# EAGLE design MainMatrix (EAGLE 9.1.1)
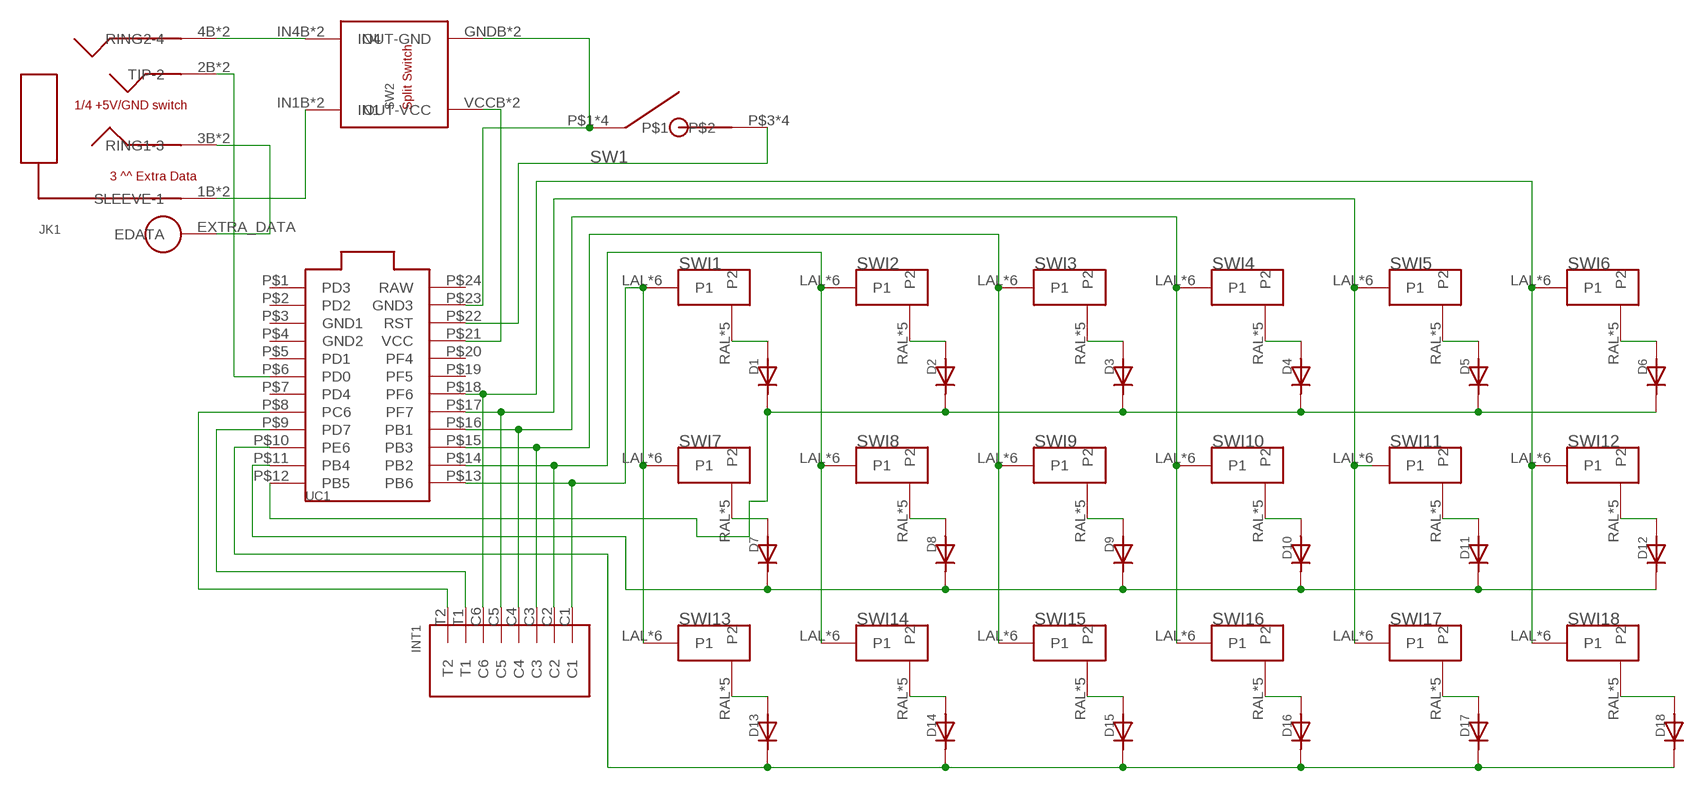
[diagram p0: schematic, sheet 1]

## Parts
D1  DIODE  [DIODE_COMBO]
D2  DIODE  [DIODE_COMBO]
D3  DIODE  [DIODE_COMBO]
D4  DIODE  [DIODE_COMBO]
D5  DIODE  [DIODE_COMBO]
D6  DIODE  [DIODE_COMBO]
D7  DIODE  [DIODE_COMBO]
D8  DIODE  [DIODE_COMBO]
D9  DIODE  [DIODE_COMBO]
D10  DIODE  [DIODE_COMBO]
D11  DIODE  [DIODE_COMBO]
D12  DIODE  [DIODE_COMBO]
D13  DIODE  [DIODE_COMBO]
D14  DIODE  [DIODE_COMBO]
D15  DIODE  [DIODE_COMBO]
D16  DIODE  [DIODE_COMBO]
D17  DIODE  [DIODE_COMBO]
D18  DIODE  [DIODE_COMBO]
INT1  INTRCNNT4X2  [INTRRIBBON]
JK1  TRRSJACKUNDER  [TRRSJACK]
SW1  RSTSWSMD  [FLATSWT]
SW2  TRANSFERPADDY  [TRANSFER_PADS]
SWI1  MX/ALPSDOUBLESIDED  [DOUBLED_MX/ALPS]
SWI2  MX/ALPSDOUBLESIDED  [DOUBLED_MX/ALPS]
SWI3  MX/ALPSDOUBLESIDED  [DOUBLED_MX/ALPS]
SWI4  MX/ALPSDOUBLESIDED  [DOUBLED_MX/ALPS]
SWI5  MX/ALPSDOUBLESIDED  [DOUBLED_MX/ALPS]
SWI6  MX/ALPSDOUBLESIDED  [DOUBLED_MX/ALPS]
SWI7  MX/ALPSDOUBLESIDED  [DOUBLED_MX/ALPS]
SWI8  MX/ALPSDOUBLESIDED  [DOUBLED_MX/ALPS]
SWI9  MX/ALPSDOUBLESIDED  [DOUBLED_MX/ALPS]
SWI10  MX/ALPSDOUBLESIDED  [DOUBLED_MX/ALPS]
SWI11  MX/ALPSDOUBLESIDED  [DOUBLED_MX/ALPS]
SWI12  MX/ALPSDOUBLESIDED  [DOUBLED_MX/ALPS]
SWI13  MX/ALPSDOUBLESIDED  [DOUBLED_MX/ALPS]
SWI14  MX/ALPSDOUBLESIDED  [DOUBLED_MX/ALPS]
SWI15  MX/ALPSDOUBLESIDED  [DOUBLED_MX/ALPS]
SWI16  MX/ALPSDOUBLESIDED  [DOUBLED_MX/ALPS]
SWI17  MX/ALPSDOUBLESIDED  [DOUBLED_MX/ALPS]
SWI18  MX/ALPSDOUBLESIDED  [DOUBLED_MX/ALPS]
UC1  PROMICROUNDER  [PROMICRO_UNDER]

## Nets
N$1: INT1.C5 SWI5.LAL(P1) SWI5.LAR(P1) SWI5.LCL(P1) SWI5.LCR(P1) SWI5.LLP(P1) SWI5.LRLP(P1) SWI11.LAL(P1) SWI11.LAR(P1) SWI11.LCL(P1) SWI11.LCR(P1) SWI11.LLP(P1) SWI11.LRLP(P1) SWI17.LAL(P1) SWI17.LAR(P1) SWI17.LCL(P1) SWI17.LCR(P1) SWI17.LLP(P1) SWI17.LRLP(P1) UC1.P$17(PF7)
N$2: D1.ANOSB(AN) D1.ANOST(AN) D1.ANOT(AN) SWI1.RAL(P2) SWI1.RAR(P2) SWI1.RCL(P2) SWI1.RCR(P2) SWI1.RLMID(P2)
N$3: D2.ANOSB(AN) D2.ANOST(AN) D2.ANOT(AN) SWI2.RAL(P2) SWI2.RAR(P2) SWI2.RCL(P2) SWI2.RCR(P2) SWI2.RLMID(P2)
N$4: D3.ANOSB(AN) D3.ANOST(AN) D3.ANOT(AN) SWI3.RAL(P2) SWI3.RAR(P2) SWI3.RCL(P2) SWI3.RCR(P2) SWI3.RLMID(P2)
N$5: D4.ANOSB(AN) D4.ANOST(AN) D4.ANOT(AN) SWI4.RAL(P2) SWI4.RAR(P2) SWI4.RCL(P2) SWI4.RCR(P2) SWI4.RLMID(P2)
N$6: D5.ANOSB(AN) D5.ANOST(AN) D5.ANOT(AN) SWI5.RAL(P2) SWI5.RAR(P2) SWI5.RCL(P2) SWI5.RCR(P2) SWI5.RLMID(P2)
N$7: D6.ANOSB(AN) D6.ANOST(AN) D6.ANOT(AN) SWI6.RAL(P2) SWI6.RAR(P2) SWI6.RCL(P2) SWI6.RCR(P2) SWI6.RLMID(P2)
N$8: D7.ANOSB(AN) D7.ANOST(AN) D7.ANOT(AN) SWI7.RAL(P2) SWI7.RAR(P2) SWI7.RCL(P2) SWI7.RCR(P2) SWI7.RLMID(P2)
N$9: D8.ANOSB(AN) D8.ANOST(AN) D8.ANOT(AN) SWI8.RAL(P2) SWI8.RAR(P2) SWI8.RCL(P2) SWI8.RCR(P2) SWI8.RLMID(P2)
N$10: D9.ANOSB(AN) D9.ANOST(AN) D9.ANOT(AN) SWI9.RAL(P2) SWI9.RAR(P2) SWI9.RCL(P2) SWI9.RCR(P2) SWI9.RLMID(P2)
N$11: D10.ANOSB(AN) D10.ANOST(AN) D10.ANOT(AN) SWI10.RAL(P2) SWI10.RAR(P2) SWI10.RCL(P2) SWI10.RCR(P2) SWI10.RLMID(P2)
N$12: D11.ANOSB(AN) D11.ANOST(AN) D11.ANOT(AN) SWI11.RAL(P2) SWI11.RAR(P2) SWI11.RCL(P2) SWI11.RCR(P2) SWI11.RLMID(P2)
N$13: D12.ANOSB(AN) D12.ANOST(AN) D12.ANOT(AN) SWI12.RAL(P2) SWI12.RAR(P2) SWI12.RCL(P2) SWI12.RCR(P2) SWI12.RLMID(P2)
N$14: D13.ANOSB(AN) D13.ANOST(AN) D13.ANOT(AN) SWI13.RAL(P2) SWI13.RAR(P2) SWI13.RCL(P2) SWI13.RCR(P2) SWI13.RLMID(P2)
N$15: D14.ANOSB(AN) D14.ANOST(AN) D14.ANOT(AN) SWI14.RAL(P2) SWI14.RAR(P2) SWI14.RCL(P2) SWI14.RCR(P2) SWI14.RLMID(P2)
N$16: D15.ANOSB(AN) D15.ANOST(AN) D15.ANOT(AN) SWI15.RAL(P2) SWI15.RAR(P2) SWI15.RCL(P2) SWI15.RCR(P2) SWI15.RLMID(P2)
N$17: D16.ANOSB(AN) D16.ANOST(AN) D16.ANOT(AN) SWI16.RAL(P2) SWI16.RAR(P2) SWI16.RCL(P2) SWI16.RCR(P2) SWI16.RLMID(P2)
N$18: D17.ANOSB(AN) D17.ANOST(AN) D17.ANOT(AN) SWI17.RAL(P2) SWI17.RAR(P2) SWI17.RCL(P2) SWI17.RCR(P2) SWI17.RLMID(P2)
N$19: D18.ANOSB(AN) D18.ANOST(AN) D18.ANOT(AN) SWI18.RAL(P2) SWI18.RAR(P2) SWI18.RCL(P2) SWI18.RCR(P2) SWI18.RLMID(P2)
N$20: D1.CATSB(CAT) D1.CATST(CAT) D1.CATT(CAT) D2.CATSB(CAT) D2.CATST(CAT) D2.CATT(CAT) D3.CATSB(CAT) D3.CATST(CAT) D3.CATT(CAT) D4.CATSB(CAT) D4.CATST(CAT) D4.CATT(CAT) D5.CATSB(CAT) D5.CATST(CAT) D5.CATT(CAT) D6.CATSB(CAT) D6.CATST(CAT) D6.CATT(CAT) UC1.P$12(PB5)
N$21: D7.CATSB(CAT) D7.CATST(CAT) D7.CATT(CAT) D8.CATSB(CAT) D8.CATST(CAT) D8.CATT(CAT) D9.CATSB(CAT) D9.CATST(CAT) D9.CATT(CAT) D10.CATSB(CAT) D10.CATST(CAT) D10.CATT(CAT) D11.CATSB(CAT) D11.CATST(CAT) D11.CATT(CAT) D12.CATSB(CAT) D12.CATST(CAT) D12.CATT(CAT) UC1.P$11(PB4)
N$22: D13.CATSB(CAT) D13.CATST(CAT) D13.CATT(CAT) D14.CATSB(CAT) D14.CATST(CAT) D14.CATT(CAT) D15.CATSB(CAT) D15.CATST(CAT) D15.CATT(CAT) D16.CATSB(CAT) D16.CATST(CAT) D16.CATT(CAT) D17.CATSB(CAT) D17.CATST(CAT) D17.CATT(CAT) D18.CATSB(CAT) D18.CATST(CAT) D18.CATT(CAT) UC1.P$10(PE6)
N$23: INT1.C1 SWI1.LAL(P1) SWI1.LAR(P1) SWI1.LCL(P1) SWI1.LCR(P1) SWI1.LLP(P1) SWI1.LRLP(P1) SWI7.LAL(P1) SWI7.LAR(P1) SWI7.LCL(P1) SWI7.LCR(P1) SWI7.LLP(P1) SWI7.LRLP(P1) SWI13.LAL(P1) SWI13.LAR(P1) SWI13.LCL(P1) SWI13.LCR(P1) SWI13.LLP(P1) SWI13.LRLP(P1) UC1.P$13(PB6)
N$24: INT1.C2 SWI2.LAL(P1) SWI2.LAR(P1) SWI2.LCL(P1) SWI2.LCR(P1) SWI2.LLP(P1) SWI2.LRLP(P1) SWI8.LAL(P1) SWI8.LAR(P1) SWI8.LCL(P1) SWI8.LCR(P1) SWI8.LLP(P1) SWI8.LRLP(P1) SWI14.LAL(P1) SWI14.LAR(P1) SWI14.LCL(P1) SWI14.LCR(P1) SWI14.LLP(P1) SWI14.LRLP(P1) UC1.P$14(PB2)
N$25: INT1.C3 SWI3.LAL(P1) SWI3.LAR(P1) SWI3.LCL(P1) SWI3.LCR(P1) SWI3.LLP(P1) SWI3.LRLP(P1) SWI9.LAL(P1) SWI9.LAR(P1) SWI9.LCL(P1) SWI9.LCR(P1) SWI9.LLP(P1) SWI9.LRLP(P1) SWI15.LAL(P1) SWI15.LAR(P1) SWI15.LCL(P1) SWI15.LCR(P1) SWI15.LLP(P1) SWI15.LRLP(P1) UC1.P$15(PB3)
N$26: INT1.C4 SWI4.LAL(P1) SWI4.LAR(P1) SWI4.LCL(P1) SWI4.LCR(P1) SWI4.LLP(P1) SWI4.LRLP(P1) SWI10.LAL(P1) SWI10.LAR(P1) SWI10.LCL(P1) SWI10.LCR(P1) SWI10.LLP(P1) SWI10.LRLP(P1) SWI16.LAL(P1) SWI16.LAR(P1) SWI16.LCL(P1) SWI16.LCR(P1) SWI16.LLP(P1) SWI16.LRLP(P1) UC1.P$16(PB1)
N$27: INT1.C6 SWI6.LAL(P1) SWI6.LAR(P1) SWI6.LCL(P1) SWI6.LCR(P1) SWI6.LLP(P1) SWI6.LRLP(P1) SWI12.LAL(P1) SWI12.LAR(P1) SWI12.LCL(P1) SWI12.LCR(P1) SWI12.LLP(P1) SWI12.LRLP(P1) SWI18.LAL(P1) SWI18.LAR(P1) SWI18.LCL(P1) SWI18.LCR(P1) SWI18.LLP(P1) SWI18.LRLP(P1) UC1.P$18(PF6)
N$28: SW2.VCCB(OUT-VCC) SW2.VCCT(OUT-VCC) UC1.P$21(VCC)
N$29: INT1.T1 UC1.P$9(PD7)
N$30: JK1.4B(RING2-4) JK1.4T(RING2-4) SW2.IN4B(IN4) SW2.IN4T(IN4)
N$31: JK1.1B(SLEEVE-1) JK1.1T(SLEEVE-1) SW2.IN1B(IN1) SW2.IN1T(IN1)
N$32: JK1.2B(TIP-2) JK1.2T(TIP-2) UC1.P$6(PD0)
N$33: INT1.T2 UC1.P$8(PC6)
N$34: SW1.P$3 SW1.P$4 SW1.P$7 SW1.P$8 UC1.P$22(RST)
N$35: SW1.P$1 SW1.P$2 SW1.P$5 SW1.P$6 SW2.GNDB(OUT-GND) SW2.GNDT(OUT-GND) UC1.P$23(GND3)
N$36: JK1.3B(RING1-3) JK1.3T(RING1-3) JK1.EXTRA_DATA(EDATA)
Unconnected: UC1.P$1(PD3) UC1.P$2(PD2) UC1.P$3(GND1) UC1.P$4(GND2) UC1.P$5(PD1) UC1.P$7(PD4) UC1.P$19(PF5) UC1.P$20(PF4) UC1.P$24(RAW)

## Library data of the parts
D1-D18 = Keys:DIODE
INT1 = Keys:INTRCNNT
JK1 = Keys:TRRSJACK
SW1 = Keys:RSTSW
SW2 = Keys:TRANSFER
SWI1-SWI18 = Keys:MX/ALPS
UC1 = Keys:PROMICRO

## Net classes
0 default: clearance 0.205 mm

## Board
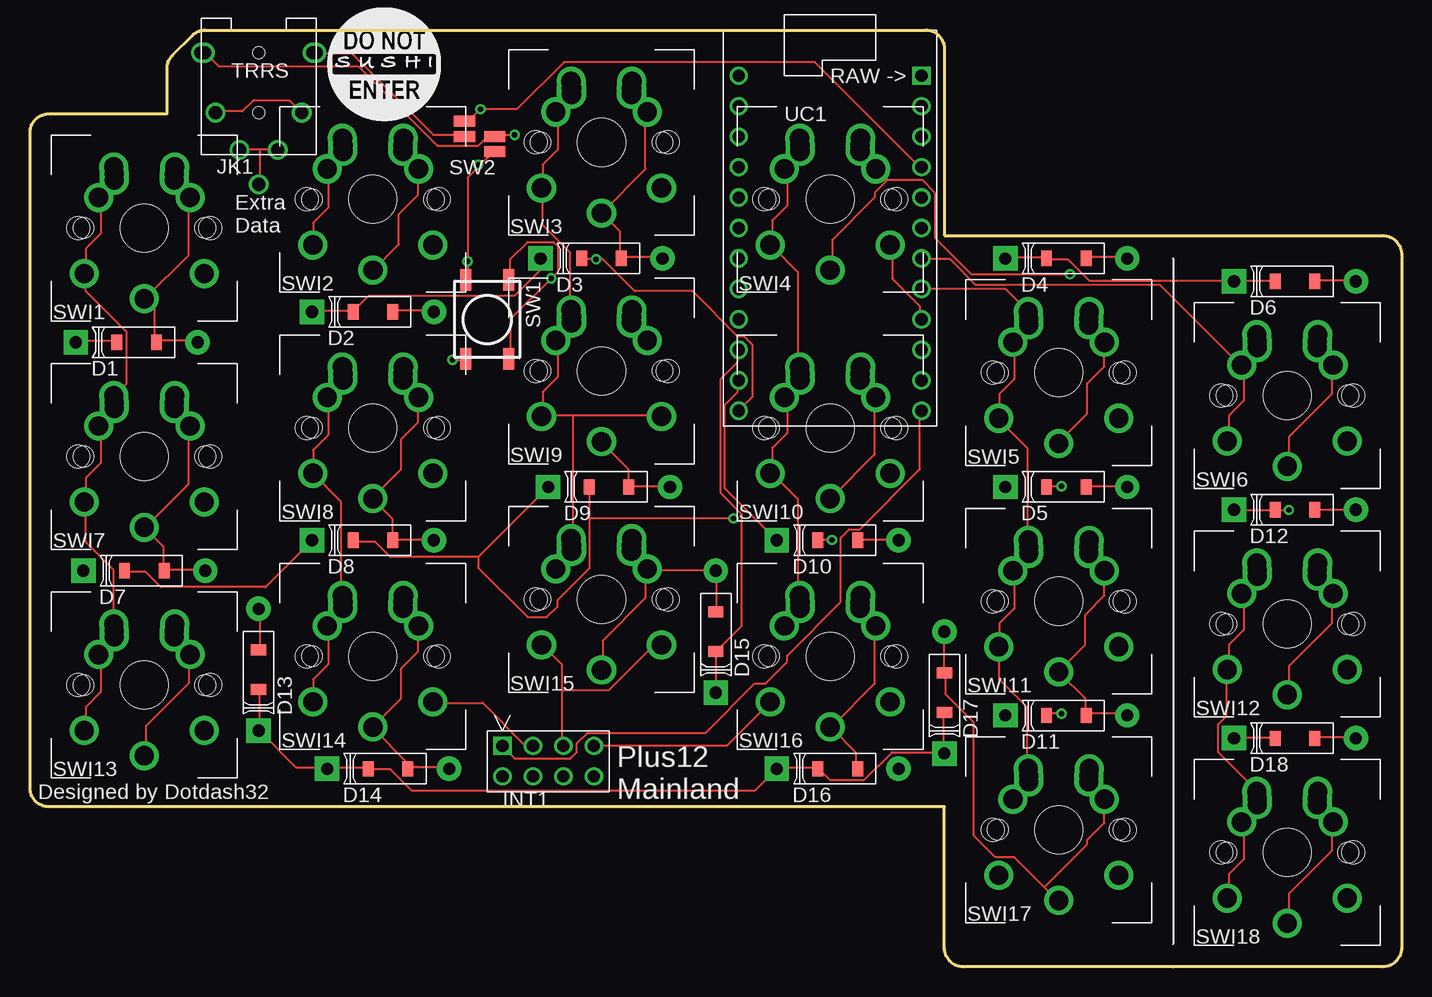
[diagram p1: board, top side]
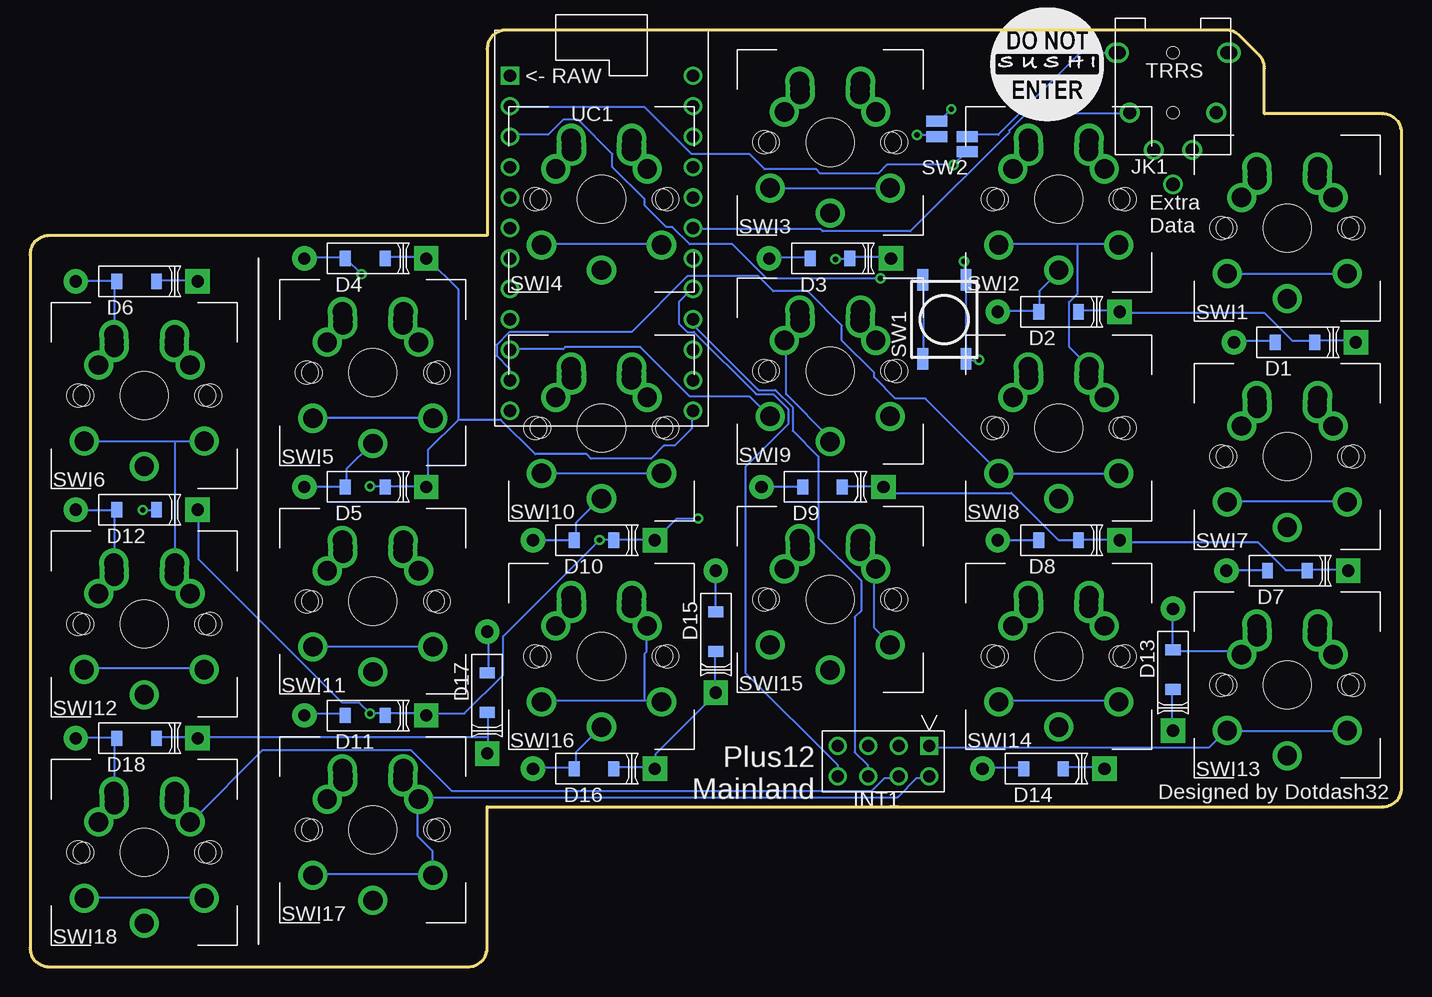
[diagram p2: board, bottom side, seen from below]

Size 114.3 x 78.1 mm. Coordinates in mm from the lower left corner, seen from the top.
Outline: 76.2,60.96 112.71,60.96 arc-90 114.3,59.37 114.3,1.59 arc-90 112.71,0 95.25,0 77.79,0 arc-90 76.2,1.59 76.2,13.34 1.59,13.34 arc-90 0,14.92 0,69.53 arc-90 1.59,71.12 11.43,71.12 11.43,74.91 arc-45 11.9,76.03 13.51,77.64 arc-45 14.63,78.1 74.61,78.1 arc-90 76.2,76.52 76.2,60.96
Copper layers (1*16): Top 0.035mm / dielectric 1.5mm / Bottom 0.035mm
Design rules "Sierra": minimum track width 6mil, minimum drill 0.45mm, track to track 6mil, track to pad 6mil, pad to pad 6mil, via to via 6mil, smd to smd 6mil, copper to edge 0.4mm, drill to drill 10mil, minimum pad ring 10mil, minimum via ring 8mil, stop-mask expansion 4mil, vias tented up to drill 0mil, thermal gap 10mil

### Footprints (pad centres in the part's own frame; a part is rotated, then mirrored left to right if it is on the bottom)
DIODE_COMBO = smd 0.914 x 1.27 bottom: ANOSB 1.651,0; CATSB -1.651,0 | smd 0.914 x 1.27: ANOST 1.651,0; CATST -1.651,0 | drill 1.016 pad 2.032: ANOT 5.08,0 | drill 1.016 pad 2.032 square: CATT -5.08,0
INTRRIBBON = drill 1.016 square: C1 0,0 | drill 1.016: C2 2.54,0; C3 5.08,0; C4 7.62,0; C5 0,-2.54; C6 2.54,-2.54; T1 5.08,-2.54; T2 7.62,-2.54
TRRSJACK = drill 1.1: 1B 4.5,-1.9; 1T 4.8,-1.9; 2B 3.6,-6.9; 2T -3.6,-6.9; 3B -1.6,-10; 3T 1.6,-10; 4B -4.8,-1.9; 4T -4.5,-1.9; EXTRA_DATA 0,-12.87 | hole 1: 0,-1.9; 0,-6.9
FLATSWT = smd 1.778 x 0.914: P$1 -3.3,-1.8; P$2 3.3,-1.8; P$3 -3.3,1.8; P$4 3.3,1.8 | smd 1.778 x 0.914 bottom: P$5 -3.3,-1.8; P$6 3.3,-1.8; P$7 -3.3,1.8; P$8 3.3,1.8
TRANSFER_PADS = smd 1.778 x 0.914 bottom: GNDB -1.27,-1.27; IN1B -1.27,0; IN4B 1.27,0; VCCB 1.27,1.27 | smd 1.778 x 0.914: GNDT 1.27,-1.27; IN1T -1.27,0; IN4T 1.27,0; VCCT -1.27,1.27
DOUBLED_MX/ALPS = drill 1.613: LAL -2.5,4; LAR -2.5,4.5; LCL -3.81,2.54; LCR -2.54,5.08; LLP -5,-3.8; LRLP 5,-3.8; RAL 2.5,4; RAR 2.5,4.5; RCL 3.81,2.54; RCR 2.54,5.08; RLMID 0,-5.9 | hole 3.988: 0,0 | hole 1.702: -5.08,0; 5.08,0 | hole 1.9: -5.5,0; 5.5,0
PROMICRO_UNDER = drill 1.016: P$1 -7.62,0; P$2 -7.62,-2.54; P$3 -7.62,-5.08; P$4 -7.62,-7.62; P$5 -7.62,-10.16; P$6 -7.62,-12.7; P$7 -7.62,-15.24; P$8 -7.62,-17.78; P$9 -7.62,-20.32; P$10 -7.62,-22.86; P$11 -7.62,-25.4; P$12 -7.62,-27.94; P$13 7.62,-27.94; P$14 7.62,-25.4; P$15 7.62,-22.86; P$16 7.62,-20.32; P$17 7.62,-17.78; P$18 7.62,-15.24; P$19 7.62,-12.7; P$20 7.62,-10.16; P$21 7.62,-7.62; P$22 7.62,-5.08; P$23 7.62,-2.54 | drill 1.016 square: P$24 7.62,0

### Placement (x,y rotation side)
D1  8.89,52.07 0 top
D2  28.57,54.61 0 top
D3  47.63,59.05 0 top
D4  86.36,59.05 0 top
D5  86.36,40.01 0 top
D6  105.41,57.15 0 top
D7  9.52,33.02 0 top
D8  28.57,35.56 0 top
D9  48.26,40.01 0 top
D10  67.31,35.56 0 top
D11  86.36,20.95 0 top
D12  105.41,38.1 0 top
D13  19.05,24.76 90 top
D14  29.85,16.51 0 top
D15  57.15,27.94 90 top
D16  67.31,16.51 0 top
D17  76.2,22.86 90 top
D18  105.41,19.05 0 top
INT1  39.37,18.41 0 top
JK1  19.05,78.1 0 top
SW1  38.1,53.98 270 top
SW2  37.46,69.22 0 top
SWI1  9.52,61.59 0 top
SWI2  28.57,63.98 0 top
SWI3  47.63,68.73 0 top
SWI4  66.68,63.98 0 top
SWI5  85.72,49.53 0 top
SWI6  104.78,47.62 0 top
SWI7  9.52,42.54 0 top
SWI8  28.57,44.93 0 top
SWI9  47.63,49.68 0 top
SWI10  66.68,44.93 0 top
SWI11  85.72,30.48 0 top
SWI12  104.78,28.57 0 top
SWI13  9.52,23.49 0 top
SWI14  28.57,25.88 0 top
SWI15  47.63,30.63 0 top
SWI16  66.68,25.88 0 top
SWI17  85.72,11.43 0 top
SWI18  104.78,9.52 0 top
U$1  [3_8INCH_BOT]  24.77,70.48 0 top
U$2  [3_8INCH_TOP]  24.77,70.48 0 top
UC1  66.68,74.29 0 top

### Tracks (layer width: path | path; a pad name or v marks a point on that pad's centre or on a via)
N$1
  Top 0.152: SWI11.LAL 83.28,34.51 83.28,34.87 SWI11.LAR | SWI11.LAL 83.28,35.05 83.28,35.41 SWI11.LCR 83.1,35.59 83.1,43.27 80.78,45.59 SWI5.LLP 80.78,45.77 80.78,47.74 82.03,48.99 82.03,52.03 SWI5.LCL 81.85,52.2 83.1,53.45 SWI5.LAR 83.1,53.99 SWI5.LCR 83.1,54.71 | SWI11.LAL 83.1,34.33 81.85,33.08 SWI11.LCL 82.03,32.9 82.03,29.87 80.78,28.62 80.78,26.83 SWI11.LLP 80.78,26.65 80.78,23.97 83.1,21.65 83.1,16.64 SWI17.LAR | 83.1,54.71 81.31,56.49 74.34,56.49 UC1.P$17 | 83.1,54.71 SWI5.LAL 83.1,54.71 | SWI17.LAL 83.28,16.11 83.28,16.46 SWI17.LCR 83.28,15.93 SWI17.LAR | SWI17.LAR 83.1,15.39 81.85,14.14 SWI17.LCL
  Bottom 0.152: SWI11.LRLP 90.61,26.65 80.78,26.65 SWI11.LLP | SWI5.LRLP 90.61,45.77 80.78,45.77 SWI5.LLP | INT1.C5 39.5,15.75 40.39,15.75 42,14.14 81.85,14.14 SWI17.LCL 82.03,13.96 82.03,10.92 80.78,9.67 80.78,7.71 | 80.78,7.71 SWI17.LLP 80.78,7.71 | 80.78,7.71 90.61,7.71 SWI17.LRLP
N$2
  Top 0.152: SWI1.RAL 12.16,65.61 12.16,65.96 SWI1.RAR | SWI1.RAL 11.98,65.43 13.23,64.18 SWI1.RCL 13.23,64 13.23,59.35 9.65,55.78 SWI1.RLMID 9.65,55.6 10.37,54.88 10.37,52.2 D1.ANOST 10.55,52.2 13.94,52.2 D1.ANOT | SWI1.RCR 12.16,66.5 12.16,66.14 SWI1.RAL
  Bottom 0.152: D1.ANOST 10.55,52.2 13.94,52.2 D1.ANOT
N$3
  Top 0.152: SWI2.RAR 31.1,68.47 31.1,68.11 SWI2.RAL 31.1,67.93 | 31.1,67.93 32.35,66.68 SWI2.RCL 32.35,66.5 32.35,64.36 30.74,62.75 30.74,60.25 28.6,58.1 SWI2.RLMID | 31.1,67.93 SWI2.RCR 31.1,67.93 | D2.ANOST 30.38,54.71 33.6,54.71 D2.ANOT
  Bottom 0.152: D2.ANOT 33.6,54.71 30.38,54.71 D2.ANOST 30.21,54.71 30.21,56.31 28.6,57.92 SWI2.RLMID
N$4
  Top 0.152: SWI3.RAL 50.22,72.75 50.22,73.11 SWI3.RAR | SWI3.RAL 50.04,72.58 51.29,71.32 SWI3.RCL 51.29,71.15 51.29,66.5 47.72,62.93 SWI3.RLMID 47.72,62.75 49.15,61.32 49.15,59.17 D3.ANOST 49.33,59.17 52.54,59.17 D3.ANOT | SWI3.RCR 50.22,73.65 50.22,73.29 SWI3.RAL
  Bottom 0.152: D3.ANOST 49.33,59.17 52.54,59.17 D3.ANOT
N$5  (via drill 0.45)
  Top 0.152: 69.16,68.47 69.16,68.11 SWI4.RAL 69.16,68.47 | 69.16,68.47 SWI4.RCR | 69.16,68.47 SWI4.RAR 69.34,67.93 70.59,66.68 SWI4.RCL 70.59,66.5 71.49,65.61 | D4.ANOST 88.1,59.17 91.32,59.17 D4.ANOT | v86.67,57.74 78.45,57.74 75.42,60.78 75.42,64.53 74.34,65.61 71.49,65.61 | 71.49,65.61 70.41,64.53 70.41,64.18 66.84,60.6 66.84,58.1 SWI4.RLMID
  Bottom 0.152: D4.ANOT 91.32,59.17 88.1,59.17 D4.ANOST 87.92,58.99 v86.67,57.74
N$6
  Top 0.152: SWI5.RAL 88.28,53.63 88.28,53.99 SWI5.RAR | SWI5.RAL 88.28,53.45 89.53,52.2 SWI5.RCL 89.53,52.03 89.53,50.06 88.1,48.63 88.1,46.13 85.78,43.8 SWI5.RLMID | SWI5.RCR 88.28,54.53 88.28,54.17 SWI5.RAL | D5.ANOST 88.1,40.05 91.32,40.05 D5.ANOT
  Bottom 0.152: D5.ANOT 91.32,40.05 88.1,40.05 D5.ANOST 87.92,40.05 87.92,41.48 85.78,43.63 SWI5.RLMID
N$7
  Top 0.152: D6.ANOST 107.22,57.21 110.44,57.21 D6.ANOT | SWI6.RCR 107.4,52.03 107.4,51.67 SWI6.RAL 107.4,52.2 SWI6.RAR 107.4,51.49 108.65,50.24 SWI6.RCL 108.48,50.06 108.48,47.74 104.9,44.16 104.9,41.84 SWI6.RLMID
  Bottom 0.152: D6.ANOT 110.44,57.21 107.22,57.21 D6.ANOST 107.22,57.03 107.22,52.74 SWI6.RCR
N$8
  Top 0.152: SWI7.RAL 12.16,46.66 12.16,47.02 SWI7.RAR | SWI7.RAL 11.98,46.49 13.23,45.23 SWI7.RCL 13.23,45.06 13.23,40.23 9.65,36.66 SWI7.RLMID 9.65,36.48 11.08,35.05 11.08,33.08 D7.ANOST 11.26,33.08 14.48,33.08 D7.ANOT | SWI7.RCR 12.16,47.56 12.16,47.2 SWI7.RAL
  Bottom 0.152: D7.ANOST 11.26,33.08 14.48,33.08 D7.ANOT
N$9
  Top 0.152: 31.1,48.99 31.1,49.34 SWI8.RAR | 31.1,48.99 SWI8.RAL 31.1,48.99 | 31.1,48.99 SWI8.RCR 31.1,48.81 32.35,47.56 SWI8.RCL 32.35,47.38 32.35,45.41 30.92,43.98 30.92,41.48 28.6,39.16 SWI8.RLMID 28.6,38.98 30.21,37.37 30.21,35.59 D8.ANOST 30.38,35.59 33.6,35.59 D8.ANOT
  Bottom 0.152: D8.ANOST 30.38,35.59 33.6,35.59 D8.ANOT
N$10
  Top 0.152: SWI9.RAL 50.22,53.81 50.22,54.17 SWI9.RAR | SWI9.RCL 51.29,52.38 50.04,53.63 SWI9.RAL | SWI9.RCR 50.22,54.71 50.22,54.35 SWI9.RAL | D9.ANOT 53.26,40.05 50.04,40.05 D9.ANOST 49.86,40.05 49.86,41.48 47.72,43.63 SWI9.RLMID
  Bottom 0.152: D9.ANOST 50.04,40.05 53.26,40.05 D9.ANOT | SWI9.RCL 51.29,52.2 51.29,47.74 47.72,44.16 47.72,43.8 SWI9.RLMID
N$11
  Top 0.152: 69.16,48.99 69.16,49.34 SWI10.RAR | 69.16,48.99 SWI10.RAL 69.16,48.99 | 69.16,48.99 SWI10.RCR 69.16,48.81 70.41,47.56 SWI10.RCL 70.41,47.38 70.41,42.73 66.84,39.16 SWI10.RLMID | D10.ANOST 68.98,35.59 72.38,35.59 D10.ANOT
  Bottom 0.152: D10.ANOT 72.38,35.59 68.98,35.59 D10.ANOST 68.8,35.59 68.8,37.01 66.84,38.98 SWI10.RLMID
N$12
  Top 0.152: SWI11.RAL 88.28,34.51 88.28,34.87 SWI11.RAR | SWI11.RAL 88.28,34.33 89.53,33.08 SWI11.RCL 89.53,32.9 89.53,30.94 87.92,29.33 87.92,26.83 85.78,24.68 SWI11.RLMID 85.78,24.51 87.92,22.36 87.92,21.11 D11.ANOST 88.1,21.11 91.32,21.11 D11.ANOT | SWI11.RCR 88.28,35.41 88.28,35.05 SWI11.RAL
  Bottom 0.152: D11.ANOST 88.1,21.11 91.32,21.11 D11.ANOT
N$13
  Top 0.152: D12.ANOST 107.22,38.09 110.44,38.09 D12.ANOT | SWI12.RAL 107.4,32.73 107.4,32.9 SWI12.RAR | SWI12.RLMID 104.9,22.72 104.9,25.04 108.48,28.62 108.48,30.94 SWI12.RCL 108.48,31.12 107.4,32.19 107.4,32.55 SWI12.RCR
  Bottom 0.152: 107.22,38.09 110.44,38.09 D12.ANOT | 107.22,38.09 D12.ANOST 107.22,38.09 | 107.22,38.09 107.22,33.8 SWI12.RAR | SWI12.RCR 107.22,33.62 SWI12.RAL
N$14
  Top 0.152: SWI13.RAL 12.16,27.54 12.16,27.9 SWI13.RAR | SWI13.RCR 12.16,28.44 12.16,28.08 SWI13.RAL | D13.ANOST 19.13,26.47 19.13,29.69 D13.ANOT | SWI13.RLMID 9.65,17.71 9.65,20.04 13.23,23.61 13.23,25.93 SWI13.RCL 13.41,26.11 12.16,27.37 SWI13.RAL
  Bottom 0.152: D13.ANOT 19.13,29.69 19.13,26.47 D13.ANOST 18.95,26.29 13.59,26.29 13.41,26.11 SWI13.RCL
N$15
  Top 0.152: SWI14.RAR 31.1,30.22 31.1,30.04 SWI14.RAL 30.92,29.87 | 30.92,29.87 32.35,28.44 SWI14.RCL 32.35,28.26 32.35,26.29 30.92,24.86 30.92,22.36 28.6,20.04 SWI14.RLMID 28.6,19.86 31.46,17 31.46,16.64 D14.ANOST 31.63,16.64 34.85,16.64 D14.ANOT | 30.92,29.87 SWI14.RCR 30.92,29.87
  Bottom 0.152: D14.ANOST 31.63,16.64 34.85,16.64 D14.ANOT
N$16
  Top 0.152: SWI15.RAR 50.22,35.05 50.22,34.69 SWI15.RAL 50.22,35.23 50.22,35.59 SWI15.RCR 50.22,34.51 51.47,33.26 SWI15.RCL | D15.ANOST 57.19,29.69 57.19,32.9 D15.ANOT 57.01,33.08 51.47,33.08 SWI15.RCL | SWI15.RLMID 47.72,24.86 47.72,27.19 51.29,30.76 51.29,33.08 SWI15.RCL
  Bottom 0.152: D15.ANOST 57.19,29.69 57.19,32.9 D15.ANOT
N$17
  Top 0.152: SWI16.RAR 69.16,30.22 69.16,30.04 SWI16.RAL 69.34,29.87 | 69.34,29.87 70.41,28.79 70.41,28.44 SWI16.RCL 70.41,28.26 70.41,23.61 66.84,20.04 SWI16.RLMID 66.84,19.86 68.8,17.89 68.8,16.64 D16.ANOST | 69.34,29.87 SWI16.RCR 69.34,29.87
  Bottom 0.152: D16.ANOT 72.38,16.64 68.98,16.64 D16.ANOST 68.8,16.64 68.8,17.89 66.84,19.86 SWI16.RLMID
N$18
  Top 0.152: SWI17.RAL 88.28,15.57 88.28,15.93 SWI17.RAR | SWI17.RAL 88.28,15.39 89.53,14.14 SWI17.RCL 89.53,13.96 89.53,12 88.1,10.57 88.1,10.21 84.53,6.64 | SWI17.RCR 88.28,16.46 88.28,16.11 SWI17.RAL | D17.ANOT 76.13,27.9 76.13,24.68 D17.ANOST 76.31,24.51 76.31,22.72 78.63,20.4 78.63,10.92 80.42,9.14 82.03,9.14 84.53,6.64 | 84.53,6.64 85.6,5.56 SWI17.RLMID
  Bottom 0.152: D17.ANOST 76.13,24.68 76.13,27.9 D17.ANOT
N$19
  Top 0.152: D18.ANOST 107.22,19.14 110.44,19.14 D18.ANOT | SWI18.RCR 107.4,13.96 107.4,13.6 SWI18.RAL 107.4,14.14 SWI18.RAR 107.4,13.43 108.65,12.17 SWI18.RCL 108.48,12 108.48,9.67 104.9,6.1 104.9,3.78 SWI18.RLMID
  Bottom 0.152: D18.ANOT 110.44,19.14 107.22,19.14 D18.ANOST 107.22,18.97 107.22,14.68 SWI18.RCR
N$20  (via drill 0.45)
  Top 0.152: v85.96,40.05 84.89,40.05 D5.CATST | D6.CATST 103.65,57.21 100.43,57.21 D6.CATT 100.25,57.21 88.28,57.21 86.5,58.99 84.89,58.99 D4.CATST 84.71,59.17 81.31,59.17 D4.CATT | D3.CATST 46.11,58.99 v47.18,58.99 47.72,58.99 50.4,56.31 55.22,56.31 58.98,52.56 59.51,52.56 60.23,51.85 60.23,47.56 59.15,46.49 UC1.P$12 | D1.CATST 7.15,52.2 3.94,52.2 D1.CATT | D2.CATT 23.59,54.71 26.81,54.71 D2.CATST 26.99,54.71 28.24,55.96 40.39,55.96 42.54,58.1 42.54,58.99 D3.CATT
  Bottom 0.152: v85.96,40.05 84.89,40.05 D5.CATST 84.71,40.05 81.31,40.05 D5.CATT 81.13,40.05 81.13,43.09 78.63,45.59 | D6.CATST 103.65,57.21 100.43,57.21 D6.CATT | D4.CATST 84.71,59.17 81.31,59.17 D4.CATT 81.13,58.99 78.63,56.49 78.63,45.59 | D3.CATT 42.71,59.17 45.93,59.17 D3.CATST 46.11,58.99 v47.18,58.99 | D1.CATT 3.94,52.2 7.15,52.2 D1.CATST 7.33,52.2 9.12,52.2 11.44,54.53 23.41,54.53 D2.CATT 23.59,54.71 26.81,54.71 D2.CATST | 78.63,45.59 75.06,45.59 72.2,42.73 67.91,42.73 67.55,42.38 62.55,42.38 61.48,43.45 60.58,43.45 59.15,44.88 59.15,46.31 UC1.P$12
N$21  (via drill 0.45)
  Top 0.152: D7.CATST 8.05,32.9 9.65,32.9 10.91,31.65 19.66,31.65 23.41,35.41 D8.CATT | 37.35,34.15 30.03,34.15 28.77,35.41 26.99,35.41 D8.CATST | 37.35,34.15 43.07,39.87 D9.CATT | 46.65,37.37 46.65,33.26 43.96,30.58 43.96,30.04 43.07,29.15 41.46,29.15 37.35,33.26 37.35,34.15 | 46.65,37.37 46.65,39.87 D9.CATST | v66.84,35.59 65.77,35.59 D10.CATST | UC1.P$11 58.98,48.81 58.98,47.91 57.9,46.84 57.9,39.87 62.19,35.59 D10.CATT | v104.9,38.09 103.83,38.09 D12.CATST 103.65,38.09 100.43,38.09 D12.CATT | v85.96,21.11 84.89,21.11 D11.CATST | v58.62,37.37 46.65,37.37
  Bottom 0.152: D7.CATT 4.47,33.08 7.87,33.08 D7.CATST 8.05,33.08 9.65,33.08 11.98,35.41 23.41,35.41 D8.CATT 23.59,35.59 26.81,35.59 D8.CATST 26.99,35.59 28.6,35.59 32.53,39.52 42.71,39.52 43.07,39.87 D9.CATT 43.25,40.05 46.47,40.05 D9.CATST | v104.9,38.09 103.83,38.09 D12.CATST | D12.CATT 100.25,38.09 100.25,33.98 88.28,22 86.85,22 v85.96,21.11 84.89,21.11 D11.CATST 84.71,21.11 81.31,21.11 D11.CATT 81.13,21.11 78.1,21.11 74.88,24.33 74.88,27.54 v66.84,35.59 65.77,35.59 D10.CATST 65.59,35.59 62.37,35.59 D10.CATT 62.19,35.59 60.41,37.37 v58.62,37.37
N$22
  Top 0.152: D13.CATST 19.13,23.08 19.13,19.86 D13.CATT 19.13,19.68 22.16,16.64 24.66,16.64 D14.CATT 24.84,16.64 28.06,16.64 D14.CATST 28.24,16.46 30.03,16.46 31.81,14.68 60.41,14.68 62.19,16.46 D16.CATT 62.37,16.64 65.59,16.64 D16.CATST 65.77,16.46 66.66,15.57 69.52,15.57 71.84,17.89 76.13,17.89 | D18.CATST 103.65,19.14 100.43,19.14 D18.CATT | 76.13,17.89 76.13,21.11 D17.CATST | 76.13,17.89 D17.CATT 76.13,17.89 | D15.CATT 57.19,22.9 57.19,26.11 D15.CATST 57.19,26.29 59.33,28.44 59.33,37.73 57.55,39.52 57.55,48.99 58.98,50.42 58.98,51.31 UC1.P$10
  Bottom 0.152: D14.CATST 28.06,16.64 24.84,16.64 D14.CATT | D13.CATST 19.13,23.08 19.13,19.86 D13.CATT | D18.CATST 103.65,19.14 100.43,19.14 D18.CATT 100.25,19.14 76.13,19.14 | 76.13,19.14 76.13,17.89 D17.CATT | 76.13,19.14 76.13,21.11 D17.CATST | D16.CATST 65.59,16.64 62.37,16.64 D16.CATT 62.19,16.64 62.19,17.71 57.19,22.72 D15.CATT 57.19,22.9 57.19,26.11 D15.CATST
N$23
  Top 0.152: SWI1.LAL 7.15,65.61 7.15,65.96 SWI1.LAR | SWI1.LCR 6.97,66.5 6.97,66.14 SWI1.LAL | SWI1.LAL 6.97,65.43 5.72,64.18 SWI1.LCL 5.72,64 5.9,63.82 5.9,61.14 4.65,59.89 4.65,57.92 SWI1.LLP 4.65,57.74 4.65,56.31 8.05,52.92 8.05,48.63 7.15,47.74 SWI7.LCR | SWI7.LAR 7.15,47.02 7.15,46.66 SWI7.LAL 6.97,47.2 6.97,47.56 SWI7.LCR | SWI7.LCR 6.97,46.49 5.72,45.23 SWI7.LCL 5.72,45.06 5.9,44.88 5.9,42.02 4.65,40.77 4.65,38.8 SWI7.LLP 4.65,38.62 4.65,35.41 6.97,33.08 6.97,28.62 SWI13.LCR 6.97,28.44 6.97,28.08 SWI13.LAL | SWI13.LAL 7.15,27.54 7.15,27.9 SWI13.LAR | SWI13.LLP 4.65,19.86 4.65,21.65 5.9,22.9 5.9,25.76 5.72,25.93 SWI13.LCL 5.72,26.11 6.97,27.37 SWI13.LAL | UC1.P$13 74.16,46.31 74.16,41.48 69.16,36.48 68.27,36.48 67.55,35.76 67.55,30.4 63.09,25.93 63.09,25.4 61.3,23.61 60.41,23.61 56.29,19.5 46.47,19.5 45.57,18.61 45.57,17.89 45.04,17.36 40.39,17.36 39.5,18.25 INT1.C1
  Bottom 0.152: SWI1.LRLP 14.48,57.74 4.65,57.74 SWI1.LLP | SWI7.LRLP 14.48,38.8 4.65,38.8 SWI7.LLP | INT1.C1 39.32,18.25 16.09,18.25 14.66,19.68 SWI13.LRLP 14.48,19.68 4.65,19.68 SWI13.LLP
N$24
  Top 0.152: INT1.C2 41.82,18.43 41.28,18.43 37.71,22 33.6,22 SWI14.LRLP | SWI14.LAR 26.1,30.22 26.1,30.04 SWI14.LAL 26.1,30.4 26.1,30.94 SWI14.LCR | SWI14.LLP 23.59,22.18 23.59,23.97 24.84,25.22 24.84,28.26 SWI14.LCL 24.84,28.44 25.92,29.51 25.92,29.87 SWI14.LCR | SWI2.LAR 26.1,68.47 26.1,68.11 SWI2.LAL 26.1,68.65 26.1,69 SWI2.LCR 25.92,67.93 24.66,66.68 SWI2.LCL 24.84,66.5 24.84,63.28 23.59,62.03 23.59,60.25 SWI2.LLP | SWI8.LAR 26.1,49.34 26.1,48.99 SWI8.LAL 26.1,49.52 26.1,49.88 SWI8.LCR 25.92,48.81 24.66,47.56 SWI8.LCL 24.84,47.38 24.84,44.34 23.59,43.09 23.59,41.3 SWI8.LLP 23.59,41.12 25.92,38.8 25.92,31.12 SWI14.LCR
  Bottom 0.152: SWI14.LRLP 33.42,22.18 23.59,22.18 SWI14.LLP | 26.99,60.25 23.59,60.25 SWI2.LLP | 26.99,60.25 33.42,60.25 SWI2.LRLP | UC1.P$14 74.34,48.99 74.34,49.88 75.42,50.95 75.42,51.85 74.34,52.92 64.16,52.92 59.51,57.56 53.62,57.56 52.36,56.31 49.51,56.31 46.65,53.45 46.65,52.2 43.96,49.52 43.96,49.17 42.18,47.38 39.68,47.38 33.6,41.3 SWI8.LRLP 33.42,41.12 23.59,41.12 SWI8.LLP | 26.99,60.25 26.99,56.14 27.7,55.42 27.7,51.67 26.1,50.06 SWI8.LCR
N$25
  Top 0.152: SWI15.LCL 43.96,33.26 45.22,34.51 SWI15.LCR 45.22,34.69 SWI15.LAL 45.22,35.23 SWI15.LAR 45.22,35.76 45.22,45.95 | 44.32,23.08 44.32,25.22 42.71,26.83 SWI15.LLP | 44.32,23.08 44.32,18.43 INT1.C3 | 44.32,23.08 48.25,23.08 52.01,26.83 52.54,26.83 SWI15.LRLP | SWI3.LAL 45.22,72.75 45.22,73.11 SWI3.LAR | SWI3.LCR 45.22,73.65 45.22,73.29 SWI3.LAL | SWI3.LAL 45.04,72.58 43.79,71.32 SWI3.LCL 43.96,71.15 43.96,68.11 42.71,66.86 42.71,65.07 SWI3.LLP 42.71,64.89 42.71,61.85 45.04,59.53 45.04,54.88 SWI9.LAR | SWI9.LAL 45.22,54.35 45.22,54.71 SWI9.LCR 45.22,54.17 SWI9.LAR | 42.71,45.95 42.71,47.91 43.96,49.17 43.96,52.2 SWI9.LCL 43.79,52.38 45.04,53.63 SWI9.LAR | 42.71,45.95 SWI9.LLP 42.71,45.95 | 45.22,45.95 52.54,45.95 SWI9.LRLP | 45.22,45.95 42.71,45.95
  Bottom 0.152: SWI15.LCL 43.96,33.08 43.96,28.26 42.71,27.01 SWI15.LLP | SWI3.LRLP 52.54,64.89 42.71,64.89 SWI3.LLP | UC1.P$15 74.16,51.49 69.88,51.49 69.7,51.67 63.44,51.67 59.33,47.56 54.33,47.56 52.72,45.95 SWI9.LRLP
N$26
  Top 0.152: 64.34,29.87 62.91,28.44 SWI16.LCL | 64.34,29.87 SWI16.LCR 64.34,29.87 | 64.34,29.87 SWI16.LAL 64.34,30.22 SWI16.LAR 63.98,31.12 63.98,38.98 61.84,41.12 SWI10.LLP 61.84,41.3 61.84,43.27 63.09,44.52 63.09,47.2 62.91,47.38 SWI10.LCL 62.91,47.56 64.16,48.81 SWI10.LCR | INT1.C4 47,18.43 58.08,18.43 61.66,22 SWI16.LLP | SWI10.LAR 64.16,49.34 64.16,48.99 SWI10.LAL 64.16,49.52 64.16,49.88 SWI10.LCR | UC1.P$16 74.16,53.99 74.16,55.06 71.84,57.39 71.84,60.07 SWI4.LRLP | SWI4.LAR 64.16,68.47 64.16,68.11 SWI4.LAL 64.16,68.65 64.16,69 SWI4.LCR 64.16,67.93 62.91,66.68 SWI4.LCL 62.91,66.5 63.09,66.32 63.09,63.46 61.84,62.21 61.84,60.25 SWI4.LLP 61.84,60.07 63.98,57.92 63.98,50.06 SWI10.LCR
  Bottom 0.152: 63.09,22.18 61.84,22.18 SWI16.LLP | 63.09,22.18 71.66,22.18 SWI16.LRLP | 63.09,22.18 63.09,26.11 62.91,26.29 62.91,28.26 SWI16.LCL | SWI10.LRLP 71.66,41.12 61.84,41.12 SWI10.LLP | SWI4.LRLP 71.66,60.25 61.84,60.25 SWI4.LLP
N$27
  Top 0.152: SWI12.LAR 102.4,32.9 102.4,32.73 SWI12.LAL 102.22,33.08 102.22,33.62 SWI12.LCR 102.22,32.55 100.79,31.12 SWI12.LCL 100.97,30.94 101.15,30.76 101.15,28.08 99.9,26.83 99.9,24.86 SWI12.LLP 99.72,24.68 99.72,20.93 99,20.22 99,17.89 102.22,14.68 SWI18.LCR | SWI6.LAL 102.4,51.67 102.4,52.03 SWI6.LAR | SWI6.LCR 102.22,52.56 102.22,52.2 SWI6.LAL | UC1.P$18 74.34,58.99 76.67,58.99 78.81,56.85 94.18,56.85 100.79,50.24 SWI6.LCL | SWI6.LLP 99.9,43.98 99.9,45.95 101.15,47.2 101.15,49.88 100.97,50.06 SWI6.LCL | SWI6.LAL 102.22,51.49 100.97,50.24 SWI6.LCL | SWI18.LAR 102.4,13.96 102.4,13.6 SWI18.LAL 102.22,14.14 102.22,14.5 SWI18.LCR | SWI18.LLP 99.9,5.74 99.9,7.71 101.15,8.96 101.15,11.82 100.97,12 SWI18.LCL 100.97,12.17 102.22,13.43 SWI18.LCR
  Bottom 0.152: SWI12.LRLP 109.73,24.86 99.9,24.86 SWI12.LLP | 102.22,43.8 99.9,43.8 SWI6.LLP | 102.22,43.8 109.73,43.8 SWI6.LRLP | 102.22,43.8 102.22,33.8 SWI12.LCR | INT1.C6 42,15.75 43.07,15.75 44.14,14.68 79.17,14.68 82.56,18.07 94.89,18.07 100.79,12.17 SWI18.LCL | SWI18.LRLP 109.73,5.74 99.9,5.74 SWI18.LLP
N$28  (via drill 0.45)
  Top 0.152: SW2.VCCT 36.28,70.61 36.64,70.61 v37.53,71.5 40.57,71.5 44.5,75.44 65.41,75.44 74.16,66.68 UC1.P$21
  Bottom 0.152: v37.53,71.5 38.6,70.43 SW2.VCCB
N$29
  Bottom 0.152: INT1.T1 44.5,15.93 44.5,16.82 45.57,17.89 45.57,29.15 45.04,29.69 45.04,32.19 48.61,35.76 48.61,42.55 50.76,44.7 50.76,46.66 52.18,48.09 53.62,48.09 58.98,53.45 58.98,53.81 UC1.P$9
N$30  (via drill 0.45)
  Top 0.152: v40.39,69.36 38.78,69.36 SW2.IN4B 38.6,69.18 38.07,69.18 37.35,68.47 33.96,68.47 27.35,75.08 15.73,75.08 14.66,76.15 JK1.4T 14.48,76.33 14.3,76.33 JK1.4B
  Bottom 0.152: v40.39,69.36 38.78,69.36 SW2.IN4B
N$31
  Top 0.152: 23.95,76.15 26.81,76.15 33.6,69.36 36.1,69.36 SW2.IN1T | 23.95,76.15 JK1.1B 23.95,76.15 | 23.95,76.15 JK1.1T
  Bottom 0.152: SW2.IN1T 36.1,69.36 33.6,69.36 26.81,76.15 23.95,76.15 JK1.1B
N$32
  Top 0.152: JK1.2T 15.55,71.32 17.7,71.32 18.59,72.22 21.63,72.22 22.52,71.32 JK1.2B
  Bottom 0.152: UC1.P$6 58.98,61.5 48.43,61.5 48.25,61.32 40.93,61.32 32.71,69.54 32.71,69.72 31.28,71.15 22.7,71.15 JK1.2B
N$33
  Bottom 0.152: INT1.T2 47,15.93 47,16.82 54.69,24.51 54.69,41.66 51.11,45.23 51.11,46.49 52.36,47.74 53.79,47.74 58.98,52.92 59.51,52.92 60.23,53.63 60.23,55.42 59.15,56.49 UC1.P$8
N$34  (via drill 0.45)
  Top 0.152: SW1.P$8 40.03,50.77 40.03,53.99 v43.43,57.39 43.96,57.92 43.96,60.07 43.61,60.42 41.46,60.42 40.03,58.99 40.03,57.39 SW1.P$7
  Bottom 0.152: SW1.P$8 39.85,50.77 39.85,57.21 SW1.P$7 40.03,57.39 v43.43,57.39 52.9,57.39 55.76,60.25 59.33,60.25 60.76,61.68 61.3,61.68 63.09,63.46 63.09,64 65.77,66.68 65.77,67.75 68.62,70.61 69.88,70.61 71.13,69.36 74.16,69.36 UC1.P$22
N$35  (via drill 0.45)
  Top 0.152: v35.21,50.6 36.28,50.6 SW1.P$6 | 37.53,66.86 38.6,67.93 SW2.GNDT | 37.53,66.86 36.46,65.78 v36.46,58.82 36.46,57.39 SW1.P$5 | 37.53,66.86 v37.35,66.86
  Bottom 0.152: v35.21,50.6 36.28,50.6 SW1.P$6 36.28,50.77 36.28,57.21 SW1.P$5 36.46,57.39 v36.46,58.82 | SW2.GNDB 36.28,67.93 v37.35,66.86 42.89,66.86 43.61,66.14 48.43,66.14 48.79,66.5 53.08,66.5 54.33,67.75 59.15,67.75 63.09,71.68 74.16,71.68 UC1.P$23
N$36
  Top 0.152: 19.13,68.11 20.55,68.11 JK1.3T | 19.13,68.11 17.52,68.11 JK1.3B | 19.13,68.11 19.13,65.25 JK1.EXTRA_DATA

### Text on the board
tPlace: Designed by Dotdash32 | Plus12 / Mainland
bPlace: Designed by Dotdash32 | Plus12 / Mainland